# Altium schematic sheet ethernet.SchDoc
size A4
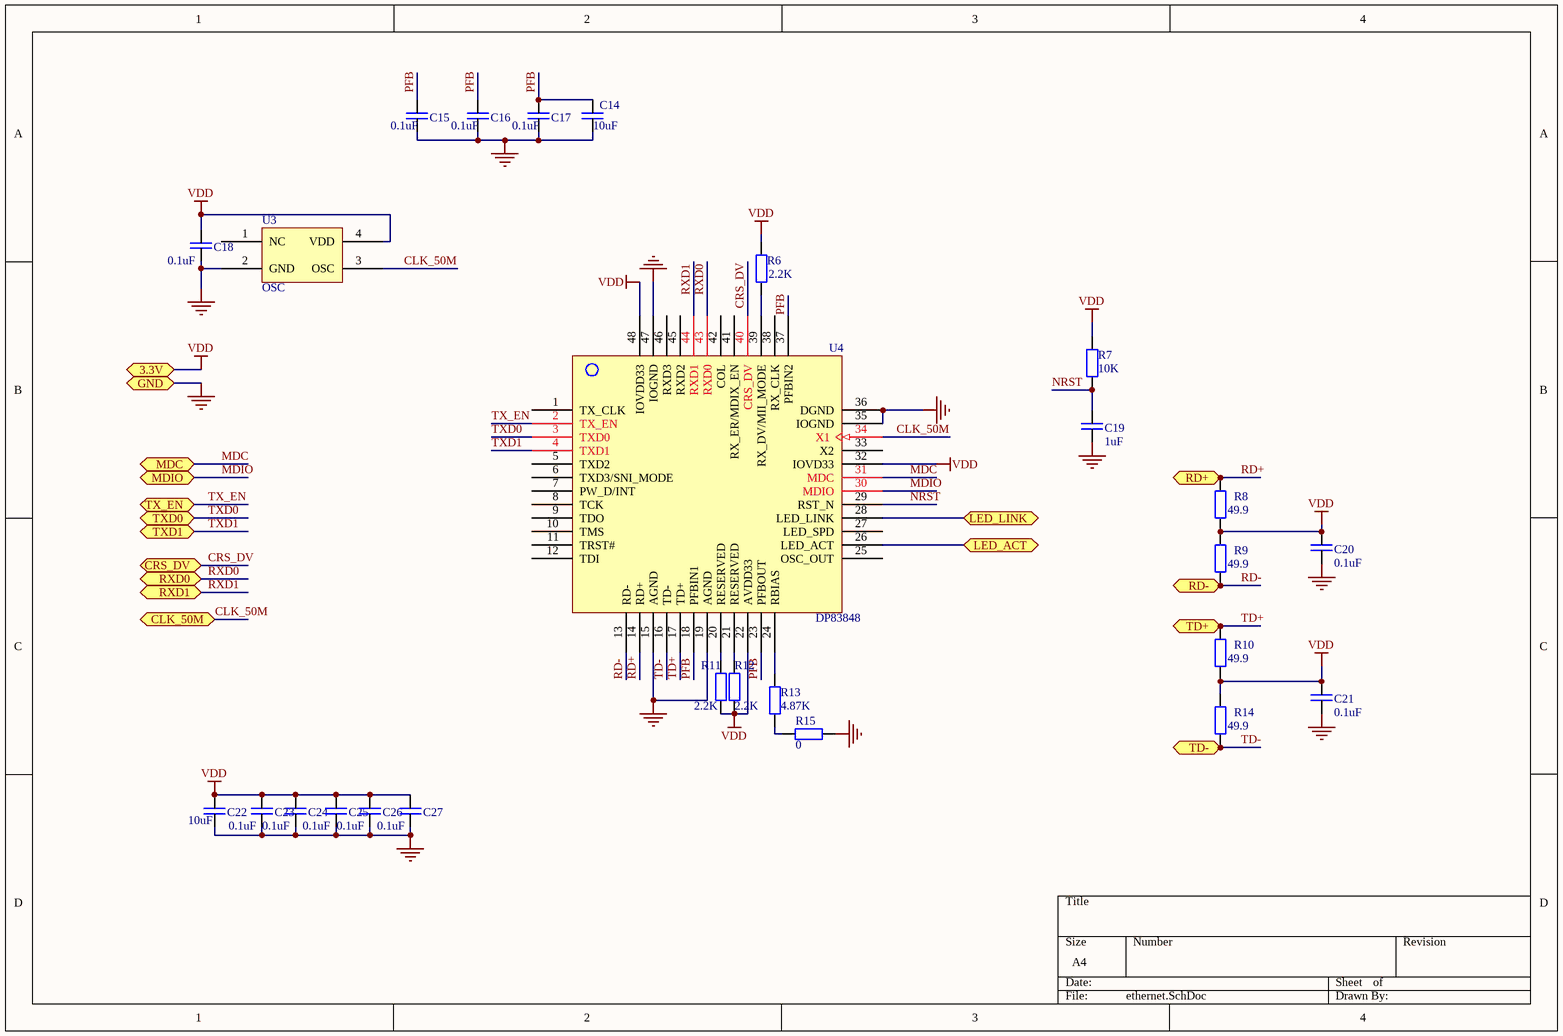
[diagram p0: ethernet.SchDoc]

## Parts
C14  value 10uF  [CAP-0805]  (hidden comment: CAP)
C15  value 0.1uF  [CAP-0805]  (hidden comment: CAP)
C16  value 0.1uF  [CAP-0805]  (hidden comment: CAP)
C17  value 0.1uF  [CAP-0805]  (hidden comment: CAP)
C18  value 0.1uF  [CAP-0805]  (hidden comment: CAP)
C19  value 1uF  [CAP-0805]  (hidden comment: CAP)
C20  value 0.1uF  [CAP-0805]  (hidden comment: CAP)
C21  value 0.1uF  [CAP-0805]  (hidden comment: CAP)
C22  value 10uF  [CAP-0805]  (hidden comment: CAP)
C23  value 0.1uF  [CAP-0805]  (hidden comment: CAP)
C24  value 0.1uF  [CAP-0805]  (hidden comment: CAP)
C25  value 0.1uF  [CAP-0805]  (hidden comment: CAP)
C26  value 0.1uF  [CAP-0805]  (hidden comment: CAP)
C27  value 0.1uF  [CAP-0805]  (hidden comment: CAP)
R6  value 2.2K  [RES-0805]  (hidden comment: RES)
R7  value 10K  [RES-0805]  (hidden comment: RES)
R8  value 49.9  [RES-0805]  (hidden comment: RES)
R9  value 49.9  [RES-0805]  (hidden comment: RES)
R10  value 49.9  [RES-0805]  (hidden comment: RES)
R11  value 2.2K  [RES-0805]  (hidden comment: RES)
R12  value 2.2K  [RES-0805]  (hidden comment: RES)
R13  value 4.87K  [RES-0805]  (hidden comment: RES)
R14  value 49.9  [RES-0805]  (hidden comment: RES)
R15  value 0  [RES-0805]  (hidden comment: RES)
U3  OSC  [OSC_S]
U4  DP83848  [LQFP48]

## Ports
3.3V, CLK_50M, CRS_DV, GND, LED_ACT, LED_LINK, MDC, MDIO, RD+, RD-, RXD0, RXD1, TD+, TD-, TX_EN, TXD0, TXD1

## Nets
GND: C14.1 C15.1 C16.1 C17.1 C18.1 C19.1 C20.1 C21.1 C22.1 C23.1 C24.1 C25.1 C26.1 C27.1 R15.1 U3.2(GND) U4.15(AGND) U4.19(AGND) U4.35(IOGND) U4.36(DGND) U4.47(IOGND) ; port GND
VDD: C18.2 C20.2 C21.2 C22.2 C23.2 C24.2 C25.2 C26.2 C27.2 R6.2 R7.2 R8.1 R9.2 R10.1 R11.1 R12.1 R14.2 U3.4(VDD) U4.22(AVDD33) U4.32(IOVD33) U4.48(IOVDD33) ; port 3.3V
CLK_50M: U3.3(OSC) U4.34(X1) ; port CLK_50M
CRS_DV: U4.40(CRS_DV) ; port CRS_DV
LED_ACT: U4.26(LED_ACT) ; port LED_ACT
LED_LINK: U4.28(LED_LINK) ; port LED_LINK
MDC: U4.31(MDC) ; port MDC
MDIO: U4.30(MDIO) ; port MDIO
NRST: C19.2 R7.1 U4.29(RST_N)
PFB: C14.2 C15.2 C16.2 C17.2 U4.18(PFBIN1) U4.23(PFBOUT) U4.37(PFBIN2)
RD+: R8.2 U4.14(RD+) ; port RD+
RD-: R9.1 U4.13(RD-) ; port RD-
RXD0: U4.43(RXD0) ; port RXD0
RXD1: U4.44(RXD1) ; port RXD1
TD+: R10.2 U4.17(TD+) ; port TD+
TD-: R14.1 U4.16(TD-) ; port TD-
TX_EN: U4.2(TX_EN) ; port TX_EN
TXD0: U4.3(TXD0) ; port TXD0
TXD1: U4.4(TXD1) ; port TXD1
NetR6_1: R6.1 U4.39(RX_DV/MII_MODE)
NetR11_2: R11.2 U4.20(RESERVED)
NetR12_2: R12.2 U4.21(RESERVED)
NetR13_1: R13.1 R15.2
NetR13_2: R13.2 U4.24(RBIAS)

Not connected (* = marked no-connect by the designer): U3 1(NC); U4 1(TX_CLK) 5(TXD2) 6(TXD3/SNI_MODE) 7(PW_D/INT) 8(TCK) 9(TDO) 10(TMS) 11(TRST#) 12(TDI) 25(OSC_OUT) 27(LED_SPD) 33(X2) 38(RX_CLK) 41(RX_ER/MDIX_EN) 42(COL) 45(RXD2) 46(RXD3)